# EAGLE schematic BB_SensorCape (EAGLE 7.2.0)
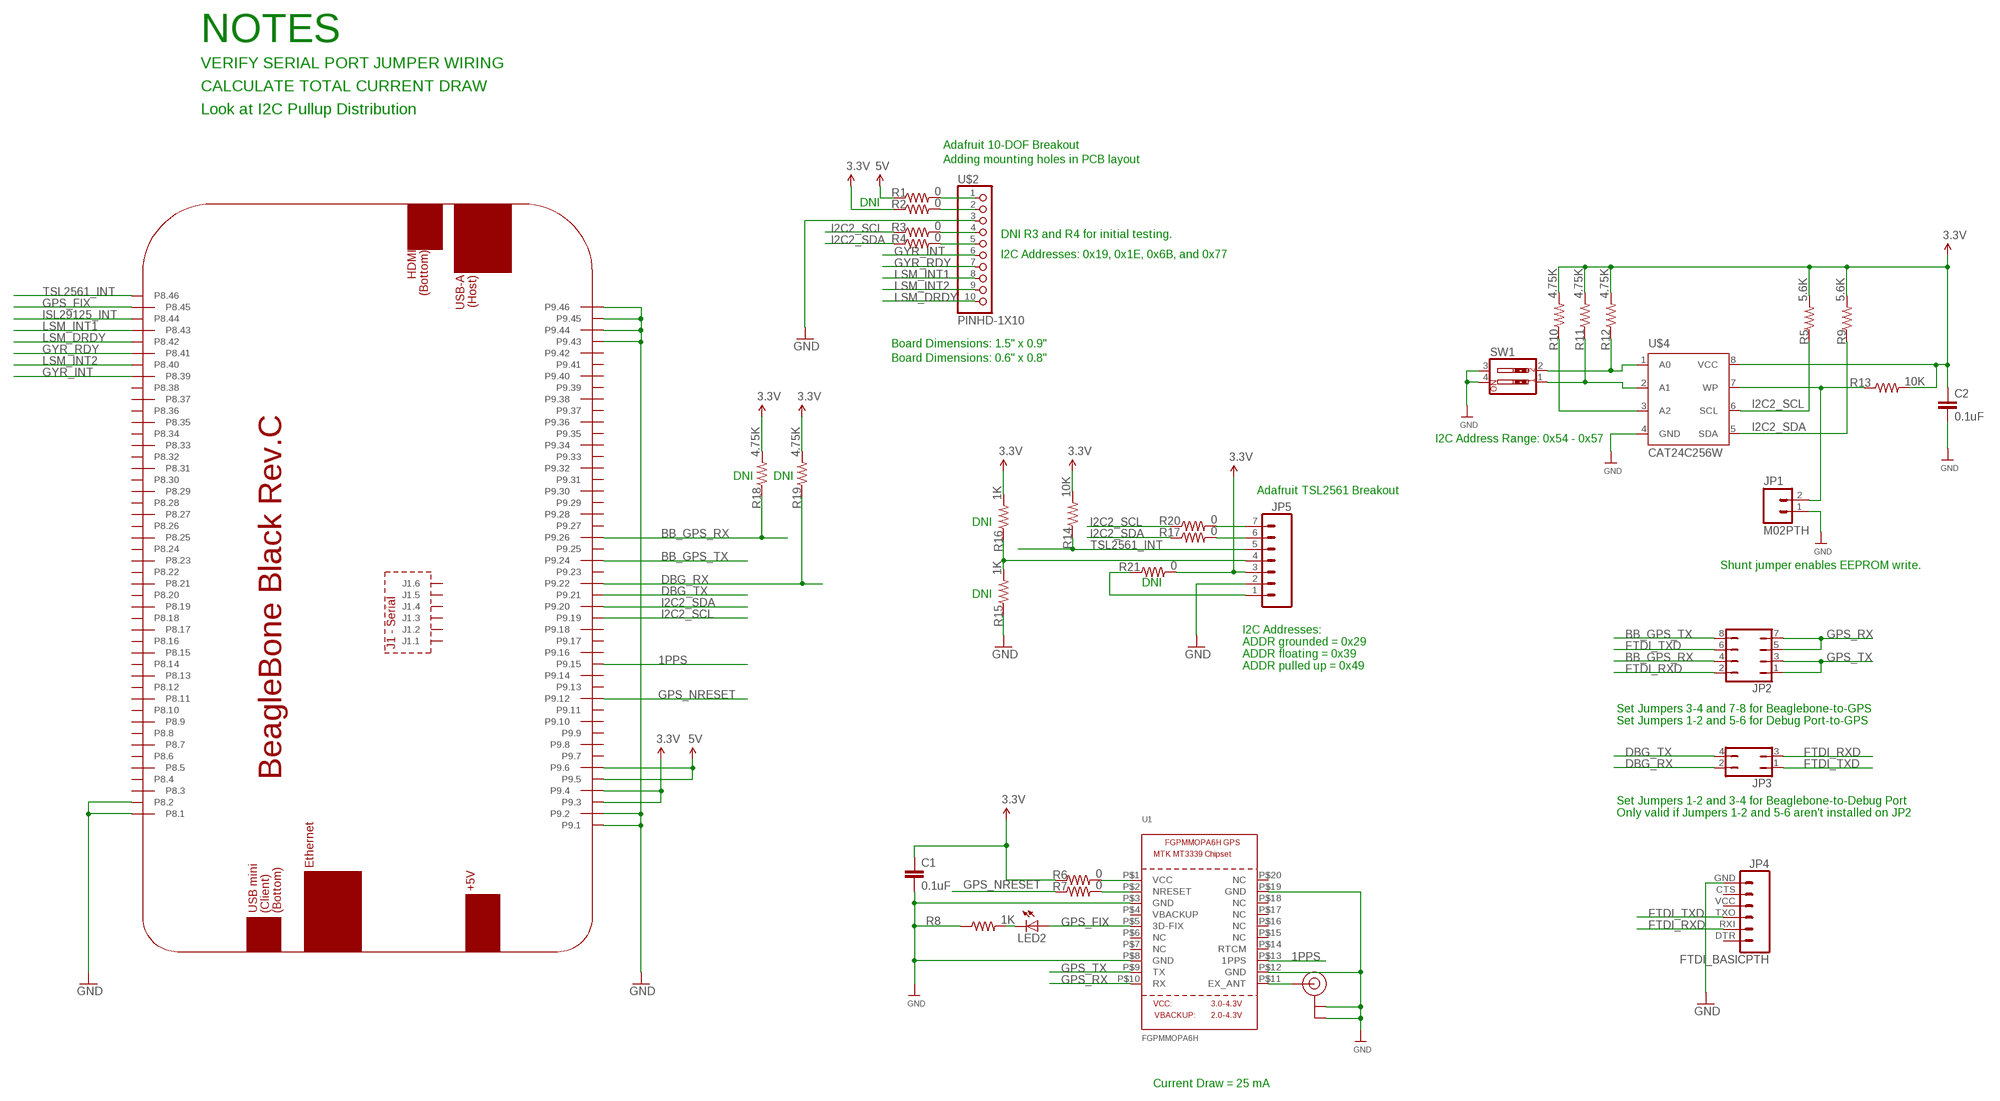
[diagram p0: schematic, sheet 1]

## Parts
C1  0.1uF  0.1UF-25V-5%(0603)  [0603-CAP]
C2  0.1uF  0.1UF-25V-5%(0603)  [0603-CAP]
JP1  M02PTH  [1X02]
JP2  JP4Q  [JP4Q]
JP3  JP2Q  [JP2Q]
JP4  FTDI_BASICPTH  [FTDI_BASIC]
JP5  M07  [1X07]
LED2  LEDCHIPLED_0805  [CHIPLED_0805]
PCB1  BEAGLEBONE_BLACK  [BEAGLEBONE_BLACK]
R1  0  R-US_R0603  [R0603]
R2  0  R-US_R0603  [R0603]
R3  0  R-US_R0603  [R0603]
R4  0  R-US_R0603  [R0603]
R5  5.6K  R-US_R0603  [R0603]
R6  0  R-US_R0603  [R0603]
R7  0  R-US_R0603  [R0603]
R8  1K  R-US_R0603  [R0603]
R9  5.6K  R-US_R0603  [R0603]
R10  4.75K  R-US_R0603  [R0603]
R11  4.75K  R-US_R0603  [R0603]
R12  4.75K  R-US_R0603  [R0603]
R13  10K  R-US_R0603  [R0603]
R14  10K  R-US_R0603  [R0603]
R15  1K  R-US_R0603  [R0603]
R16  1K  R-US_R0603  [R0603]
R17  0  R-US_R0603  [R0603]
R18  4.75K  R-US_R0603  [R0603]
R19  4.75K  R-US_R0603  [R0603]
R20  0  R-US_R0603  [R0603]
R21  0  R-US_R0603  [R0603]
SW1  SW_DIP-2-SMT-HALFSIZE  [DIPSWITCH-02-50MIL]
U1  FGPMMOPA6H  GPS_FGPMMOPA6H  [FGPMMOPA6H]
U$2  PINHD-1X10  [1X10-BIG]
U$4  CAT24C256W  [SO08]
U$20  U.FL  [U.FL]

## Nets
1PPS: PCB1.P9.15 U1.P$13(1PPS)
3.3V [power]: C1.1 C2.1 JP5.3 PCB1.P9.3 PCB1.P9.4 R2.1 R5.2 R6.1 R9.2 R10.2 R11.2 R12.2 R13.2 R14.2 R16.2 R18.2 R19.2 R21.2 U$4.8(VCC)
5V: PCB1.P9.5 PCB1.P9.6 R1.1
BB_GPS_RX: JP2.4 PCB1.P9.26 R18.1
BB_GPS_TX: JP2.8 PCB1.P9.24
DBG_RX: JP3.2 PCB1.P9.22 R19.1
DBG_TX: JP3.4 PCB1.P9.21
FTDI_RXD: JP2.2 JP3.3 JP4.RXI
FTDI_TXD: JP2.6 JP3.1 JP4.TXO
GND [power]: C1.2 C2.2 JP1.1 JP4.GND JP5.2 PCB1.P8.1 PCB1.P8.2 PCB1.P9.1 PCB1.P9.2 PCB1.P9.43 PCB1.P9.44 PCB1.P9.45 PCB1.P9.46 R8.1 R15.1 SW1.3 SW1.4 U1.P$3(GND) U1.P$8(GND) U1.P$12(GND) U1.P$19(GND) U$2.3 U$4.4(GND) U$20.P$1(GND) U$20.P$2(GND)
GPS_FIX: LED2.A PCB1.P8.45 U1.P$5(3D-FIX)
GPS_NRESET: PCB1.P9.12 R7.1
GPS_RX: JP2.5 JP2.7 U1.P$10(RX)
GPS_TX: JP2.1 JP2.3 U1.P$9(TX)
GYR_INT: PCB1.P8.39 U$2.6
GYR_RDY: PCB1.P8.41 U$2.7
I2C2_SCL: PCB1.P9.19 R3.1 R5.1 R20.1 U$4.6(SCL)
I2C2_SDA: PCB1.P9.20 R4.1 R9.1 R17.1 U$4.5(SDA)
ISL29125_INT: PCB1.P8.44
LSM_DRDY: PCB1.P8.42 U$2.10
LSM_INT1: PCB1.P8.43 U$2.8
LSM_INT2: PCB1.P8.40 U$2.9
N$1: R1.2 U$2.1
N$2: R2.2 U$2.2
N$3: R4.2 U$2.5
N$4: R3.2 U$2.4
N$5: LED2.C R8.2
N$6: R6.2 U1.P$1(VCC)
N$7: U1.P$11(EX_ANT) U$20.P$3(SIGNAL)
N$8: R7.2 U1.P$2(NRESET)
N$9: R12.1 SW1.2 U$4.1(A0)
N$10: JP5.4 R15.2 R16.1
N$11: R11.1 SW1.1 U$4.2(A1)
N$12: R10.1 U$4.3(A2)
N$13: JP1.2 R13.1 U$4.7(WP)
N$14: JP5.7 R20.2
N$15: JP5.6 R17.2
N$16: JP5.1 R21.1
TSL2561_INT: JP5.5 PCB1.P8.46 R14.1
Unconnected: JP4.CTS JP4.DTR JP4.VCC PCB1.J1.1 PCB1.J1.2 PCB1.J1.3 PCB1.J1.4 PCB1.J1.5 PCB1.J1.6 PCB1.P8.3 PCB1.P8.4 PCB1.P8.5 PCB1.P8.6 PCB1.P8.7 PCB1.P8.8 PCB1.P8.9 PCB1.P8.10 PCB1.P8.11 PCB1.P8.12 PCB1.P8.13 PCB1.P8.14 PCB1.P8.15 PCB1.P8.16 PCB1.P8.17 PCB1.P8.18 PCB1.P8.19 PCB1.P8.20 PCB1.P8.21 PCB1.P8.22 PCB1.P8.23 PCB1.P8.24 PCB1.P8.25 PCB1.P8.26 PCB1.P8.27 PCB1.P8.28 PCB1.P8.29 PCB1.P8.30 PCB1.P8.31 PCB1.P8.32 PCB1.P8.33 PCB1.P8.34 PCB1.P8.35 PCB1.P8.36 PCB1.P8.37 PCB1.P8.38 PCB1.P9.7 PCB1.P9.8 PCB1.P9.9 PCB1.P9.10 PCB1.P9.11 PCB1.P9.13 PCB1.P9.14 PCB1.P9.16 PCB1.P9.17 PCB1.P9.18 PCB1.P9.23 PCB1.P9.25 PCB1.P9.27 PCB1.P9.28 PCB1.P9.29 PCB1.P9.30 PCB1.P9.31 PCB1.P9.32 PCB1.P9.33 PCB1.P9.34 PCB1.P9.35 PCB1.P9.36 PCB1.P9.37 PCB1.P9.38 PCB1.P9.39 PCB1.P9.40 PCB1.P9.41 PCB1.P9.42 U1.P$4(VBACKUP) U1.P$6(NC) U1.P$7(NC) U1.P$14(RTCM) U1.P$15(NC) U1.P$16(NC) U1.P$17(NC) U1.P$18(NC) U1.P$20(NC)

## Notes on the sheet
- NOTES
- VERIFY SERIAL PORT JUMPER WIRING
- CALCULATE TOTAL CURRENT DRAW
- Look at I2C Pullup Distribution
- Adafruit 10-DOF Breakout
- Adding mounting holes in PCB layout
- DNI
- DNI R3 and R4 for initial testing.
- I2C Addresses: 0x19, 0x1E, 0x6B, and 0x77
- Board Dimensions: 1.5" x 0.9"
- Board Dimensions: 0.6" x 0.8"
- I2C Address Range: 0x54 - 0x57
- DNI | DNI
- Adafruit TSL2561 Breakout
- DNI
- Shunt jumper enables EEPROM write.
- DNI
- DNI
- I2C Addresses: 
  ADDR grounded = 0x29
  ADDR floating = 0x39
  ADDR pulled up = 0x49
- Set Jumpers 3-4 and 7-8 for Beaglebone-to-GPS
  Set Jumpers 1-2 and 5-6 for Debug Port-to-GPS
- Set Jumpers 1-2 and 3-4 for Beaglebone-to-Debug Port
  Only valid if Jumpers 1-2 and 5-6 aren't installed on JP2
- Current Draw = 25 mA

## Library data of the parts
C1 C2 = SparkFun-Capacitors:0.1UF-25V-5%(0603): CAP-08604; PROD_ID: CAP-08604
JP1 = SparkFun-Connectors:M02: Standard 2-pin 0.1" header. Use with - straight break away headers ( PRT-00116) - right angle break away headers (PRT-00553) - swiss pins (PRT-00743) - machine pins (PRT-00117) - female headers (PRT-00115) Molex polarized connector foot print use with: PRT-08233 with associated crimp pins and housings. 2.54_SCREWTERM for use with PRT-10571. 3.5mm Screw Terminal footprints for PRT-08084 5mm Screw Terminal footprints for use with PRT-08432
JP2 = jumper:JP4Q: JUMPER
JP3 = jumper:JP2Q: JUMPER
JP4 = SparkFun-Connectors:FTDI_BASIC: FTDI Basic header with labels
JP5 = SparkFun-Connectors:M07: Header 7 Standard 7-pin 0.1" header. Use with straight break away headers (SKU : PRT-00116), right angle break away headers (PRT-00553), swiss pins (PRT-00743), machine pins (PRT-00117), and female headers (PRT-00115). NOTES ON THE VARIANTS LOCK and LOCK_LONGPADS... This footprint was designed to help hold the alignment of a through-hole component (i.e. 7-pin header) while soldering it into place. You may notice that each hole has been shifted either up or down by 0.005 of an inch from it's more standard position (which is usually a perfectly straight line). This slight alteration caused the pins (the squares in the middle) to touch the edges of the holes. Because they are alternating, it causes a "brace" to hold the header in place. 0.005 has proven to be the perfect amount of "off-center" position when using our standard breakaway headers. Although looks a little odd when you look at the bare footprint, once you have a header in there, the alteration is very hard to notice. Also, if you push a header all the way into place, it is covered up entirely on the bottom side. This idea of altering the position of holes to aid alignment will be further integrated into the Sparkfun Library for other footprints. It can help hold any component with 3 or more connection pins.
LED2 = adafruit:LED: LED OSRAM: - CHIPLED LG R971, LG N971, LY N971, LG Q971, LY Q971, LO R971, LY R971 LH N974, LH R974 LS Q976, LO Q976, LY Q976 LO Q996 - Hyper CHIPLED LW Q18S LB Q993, LB Q99A, LB R99A - SideLED LS A670, LO A670, LY A670, LG A670, LP A670 LB A673, LV A673, LT A673, LW A673 LH A674 LY A675 LS A676, LA A676, LO A676, LY A676, LW A676 LS A679, LY A679, LG A679 - Hyper Micro SIDELED® LS Y876, LA Y876, LO Y876, LY Y876 LT Y87S - SmartLED LW L88C, LW L88S LB L89C, LB L89S, LG L890 LS L89K, LO L89K, LY L89K LS L896, LA L896, LO L896, LY L896 - TOPLED LS T670, LO T670, LY T670, LG T670, LP T670 LSG T670, LSP T670, LSY T670, LOP T670, LYG T670 LG T671, LOG T671, LSG T671 LB T673, LV T673, LT T673, LW T673 LH T674 LS T676, LA T676, LO T676, LY T676, LB T676, LH T676, LSB T676, LW T676 LB T67C, LV T67C, LT T67C, LS T67K, LO T67K, LY T67K, LW E67C LS E67B, LA E67B, LO E67B, LY E67B, LB E67C, LV E67C, LT E67C LW T67C LS T679, LY T679, LG T679 LS T770, LO T770, LY T770, LG T770, LP T770 LB T773, LV T773, LT T773, LW T773 LH T774 LS E675, LA E675, LY E675, LS T675 LS T776, LA T776, LO T776, LY T776, LB T776 LHGB T686 LT T68C, LB T68C - Hyper Mini TOPLED® LB M676 - Mini TOPLED Santana® LG M470 LS M47K, LO M47K, LY M47K Source: http://www.osram.convergy.de/
PCB1 = e14_BeagleBoneBlack_RevA:BEAGLEBONE_BLACK: BeagleBone Black Rev. C device with associated package to help create a cape. NOTE: Other considerations when making a Cape (mechanical allowances for tall BBB components, EEPROM requirements, and power ratings) can be found in the BBB System Reference Manual More information available at http://www.element14.com/community/community/designcenter/single-board-computers/next-gen_beaglebone
R1-R21 = resistor:R-US_: RESISTOR, American symbol
SW1 = SparkFun-Electromechanical:SW_DIP-2: DIP SWITCH
U1 = microbuilder:GPS_FGPMMOPA6H: GPS Module - MTK MT3339 Chipset, -165dBm sensitivity, 22 channels, 10Hz, auto-select external antenna options
U$2 = adafruit:PINHD-1X10: Pin header 1x10 0.1" spacing With round pins
U$4 = vttay03_custom:CAT24C256W: 256 kb Serial CMOS EEPROM
U$20 = microbuilder:U.FL: U.FL Antenna Connector

## Net classes
1 power: width 0.381 mm